# EAGLE design R302J (EAGLE 6.6.0)
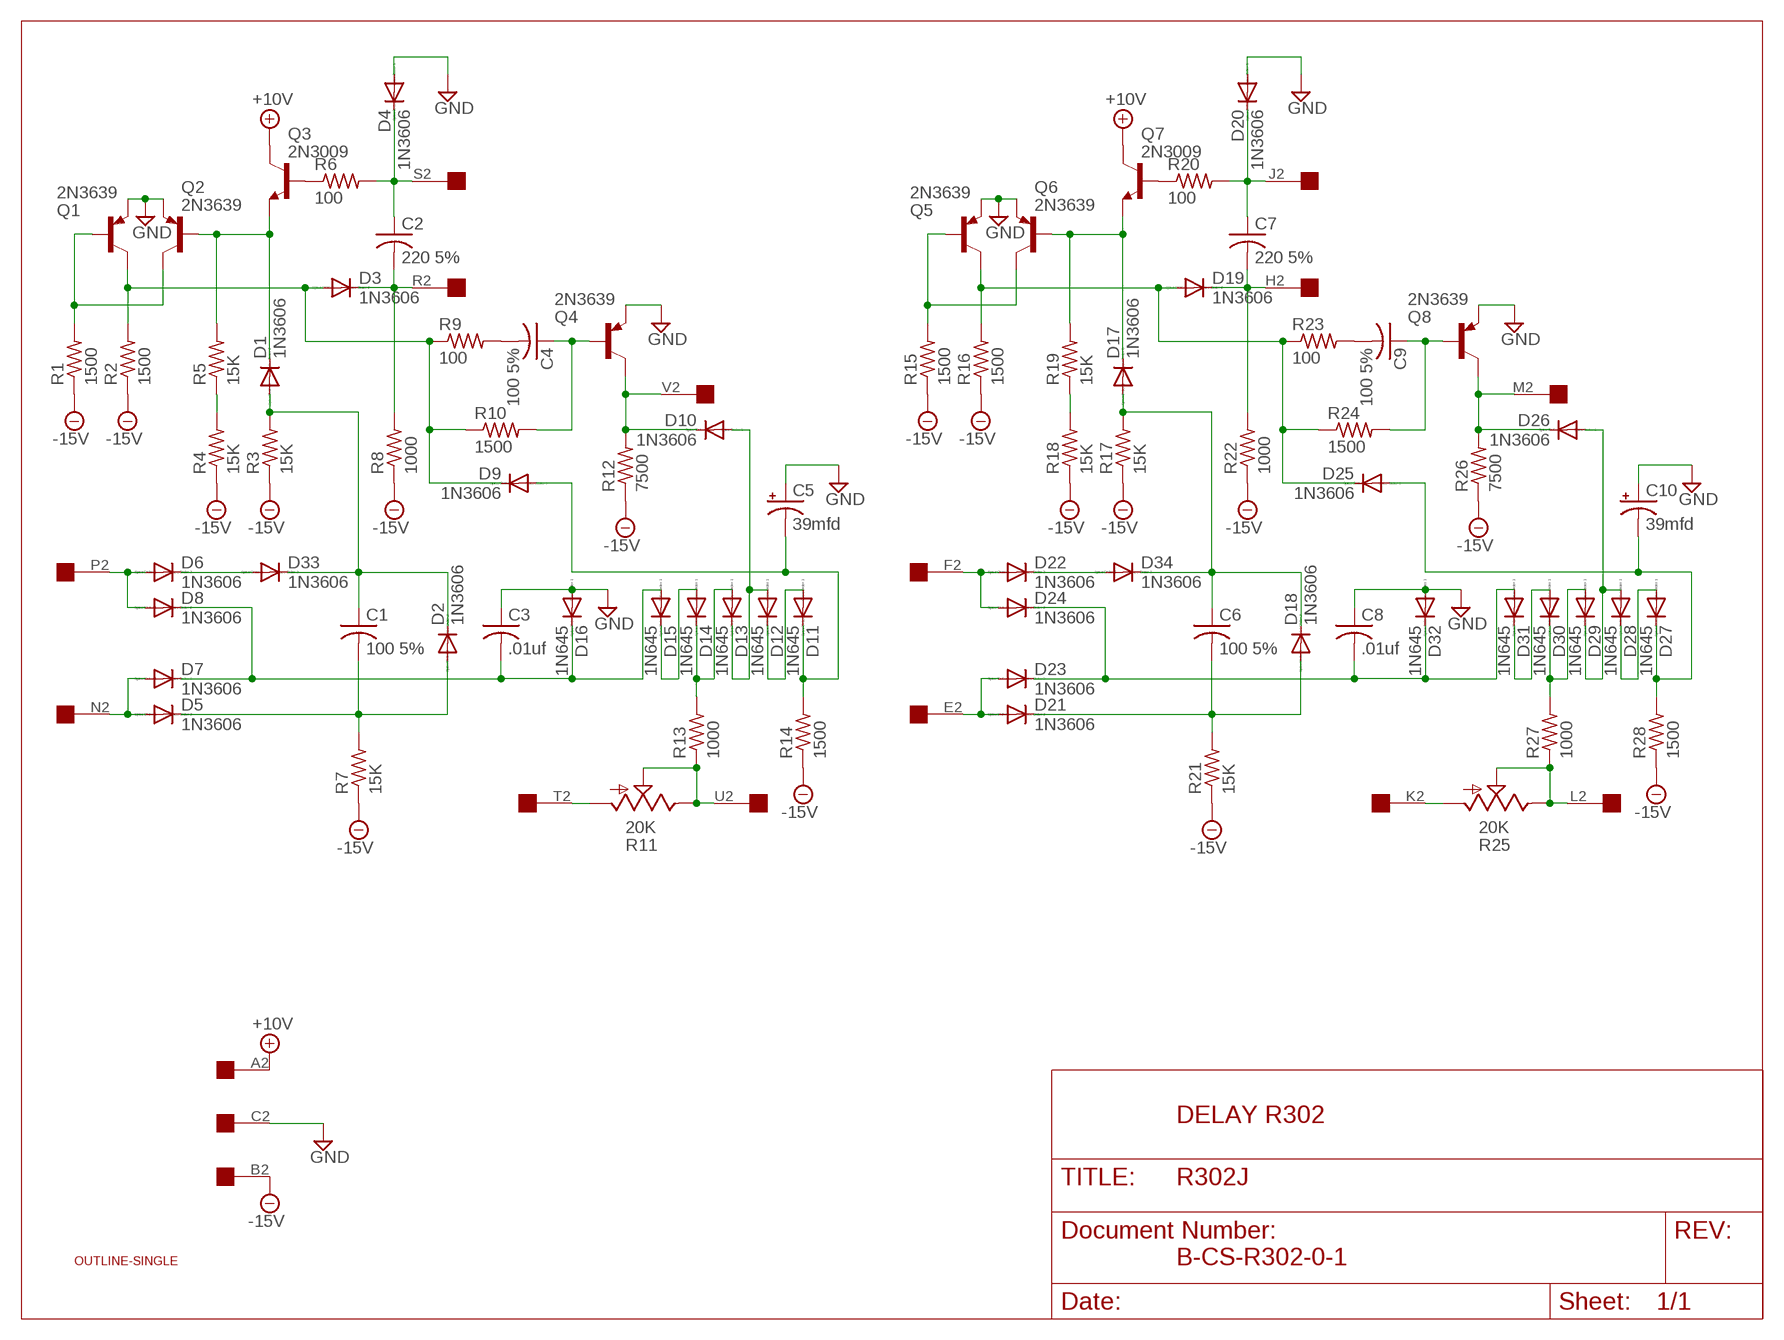
[diagram p0: schematic, sheet 1]

## Parts
C1  100 5%  C-US050-025X075  [C050-025X075]
C2  220 5%  C-US050-025X075  [C050-025X075]
C3  .01uf  C-US050-025X075  [C050-025X075]
C4  100 5%  C-US050-025X075  [C050-025X075]
C5  39mfd  CPOL-USE15-5AXIAL  [E15-5]
C6  100 5%  C-US050-025X075  [C050-025X075]
C7  220 5%  C-US050-025X075  [C050-025X075]
C8  .01uf  C-US050-025X075  [C050-025X075]
C9  100 5%  C-US050-025X075  [C050-025X075]
C10  39mfd  CPOL-USE15-5AXIAL  [E15-5]
D1  1N3606  1N4148DO35-10  [DO35-10]
D2  1N3606  1N4148DO35-10  [DO35-10]
D3  1N3606  1N4148DO35-10  [DO35-10]
D4  1N3606  1N4148DO35-10  [DO35-10]
D5  1N3606  1N4148DO35-10  [DO35-10]
D6  1N3606  1N4148DO35-10  [DO35-10]
D7  1N3606  1N4148DO35-10  [DO35-10]
D8  1N3606  1N4148DO35-10  [DO35-10]
D9  1N3606  1N4148DO35-10  [DO35-10]
D10  1N3606  1N4148DO35-10  [DO35-10]
D11  1N645  1N4148DO35-10  [DO35-10]
D12  1N645  1N4148DO35-10  [DO35-10]
D13  1N645  1N4148DO35-10  [DO35-10]
D14  1N645  1N4148DO35-10  [DO35-10]
D15  1N645  1N4148DO35-10  [DO35-10]
D16  1N645  1N4148DO35-10  [DO35-10]
D17  1N3606  1N4148DO35-10  [DO35-10]
D18  1N3606  1N4148DO35-10  [DO35-10]
D19  1N3606  1N4148DO35-10  [DO35-10]
D20  1N3606  1N4148DO35-10  [DO35-10]
D21  1N3606  1N4148DO35-10  [DO35-10]
D22  1N3606  1N4148DO35-10  [DO35-10]
D23  1N3606  1N4148DO35-10  [DO35-10]
D24  1N3606  1N4148DO35-10  [DO35-10]
D25  1N3606  1N4148DO35-10  [DO35-10]
D26  1N3606  1N4148DO35-10  [DO35-10]
D27  1N645  1N4148DO35-10  [DO35-10]
D28  1N645  1N4148DO35-10  [DO35-10]
D29  1N645  1N4148DO35-10  [DO35-10]
D30  1N645  1N4148DO35-10  [DO35-10]
D31  1N645  1N4148DO35-10  [DO35-10]
D32  1N645  1N4148DO35-10  [DO35-10]
D33  1N3606  1N4148DO35-10  [DO35-10]
D34  1N3606  1N4148DO35-10  [DO35-10]
Q1  2N3639  2N3637  [TO39]
Q2  2N3639  2N3637  [TO39]
Q3  2N3009  2N3019-NPN-TO39-EBC  [TO39]
Q4  2N3639  2N3637  [TO39]
Q5  2N3639  2N3637  [TO39]
Q6  2N3639  2N3637  [TO39]
Q7  2N3009  2N3019-NPN-TO39-EBC  [TO39]
Q8  2N3639  2N3637  [TO39]
R1  1500  R-US_0207/10  [0207/10]
R2  1500  R-US_0207/10  [0207/10]
R3  15K  R-US_0207/10  [0207/10]
R4  15K  R-US_0207/10  [0207/10]
R5  15K  R-US_0207/10  [0207/10]
R6  100  R-US_0207/10  [0207/10]
R7  15K  R-US_0207/10  [0207/10]
R8  1000  R-US_0207/10  [0207/10]
R9  100  R-US_0207/10  [0207/10]
R10  1500  R-US_0207/10  [0207/10]
R11  20K  TRIM_US-S43P  [SP19L]
R12  7500  R-US_0207/10  [0207/10]
R13  1000  R-US_0207/10  [0207/10]
R14  1500  R-US_0207/10  [0207/10]
R15  1500  R-US_0207/10  [0207/10]
R16  1500  R-US_0207/10  [0207/10]
R17  15K  R-US_0207/10  [0207/10]
R18  15K  R-US_0207/10  [0207/10]
R19  15K  R-US_0207/10  [0207/10]
R20  100  R-US_0207/10  [0207/10]
R21  15K  R-US_0207/10  [0207/10]
R22  1000  R-US_0207/10  [0207/10]
R23  100  R-US_0207/10  [0207/10]
R24  1500  R-US_0207/10  [0207/10]
R25  20K  TRIM_US-S43P  [SP19L]
R26  7500  R-US_0207/10  [0207/10]
R27  1000  R-US_0207/10  [0207/10]
R28  1500  R-US_0207/10  [0207/10]
U$1  OUTLINE-SINGLE  [SINGLE]
U$2  EDGE-1  [EDGE-CON1]

## Nets
+10V [Power]: Q3.3(C) Q7.3(C) U$2.A2
-15V [Power]: R1.1 R2.1 R3.1 R4.1 R7.1 R8.1 R12.1 R14.1 R15.1 R16.1 R17.1 R18.1 R21.1 R22.1 R26.1 R28.1 U$2.B2
GND [Power]: C3.1 C5.+ C8.1 C10.+ D4.A D16.A D20.A D32.A Q1.1(E) Q2.1(E) Q4.1(E) Q5.1(E) Q6.1(E) Q8.1(E) U$2.C2
N$1: C2.1 D4.C R6.2 U$2.S2
N$2: C2.2 D3.C R8.2 U$2.R2
N$3: D1.C Q2.2(B) Q3.1(E) R5.2
N$4: R4.2 R5.1
N$5: D22.A D24.A U$2.F2
N$6: Q3.2(B) R6.1
N$7: R11.E R11.S R13.1 U$2.U2
N$8: C1.1 D1.A D2.C D33.C R3.2
N$9: D5.A D7.A U$2.N2
N$10: R11.A U$2.T2
N$11: D6.C D33.A
N$12: D6.A D8.A U$2.P2
N$13: C1.2 D2.A D5.C R7.2
N$14: C3.2 D7.C D8.C D15.A D16.C
N$15: C4.2 R9.2
N$16: Q1.2(B) Q2.3(C) R1.2
N$17: C4.1 Q4.2(B) R10.2
N$18: D3.A D9.C Q1.3(C) R2.2 R9.1 R10.1
N$19: D10.C Q4.3(C) R12.2 U$2.V2
N$20: Q5.2(B) Q6.3(C) R15.2
N$21: D13.A D14.C R13.2
N$22: D11.A D12.C
N$23: D19.A D25.C Q5.3(C) R16.2 R23.1 R24.1
N$24: C5.- D9.A D11.C R14.2
N$25: D17.C Q6.2(B) Q7.1(E) R19.2
N$26: Q7.2(B) R20.1
N$27: C7.1 D20.C R20.2 U$2.J2
N$28: C7.2 D19.C R22.2 U$2.H2
N$29: R18.2 R19.1
N$30: D22.C D34.A
N$31: C6.1 D17.A D18.C D34.C R17.2
N$32: C6.2 D18.A D21.C R21.2
N$33: D21.A D23.A U$2.E2
N$34: C8.2 D23.C D24.C D31.A D32.C
N$35: C9.2 R23.2
N$36: C9.1 Q8.2(B) R24.2
N$37: D26.C Q8.3(C) R26.2 U$2.M2
N$38: D29.A D30.C R27.2
N$39: D27.A D28.C
N$40: C10.- D25.A D27.C R28.2
N$41: R25.E R25.S R27.1 U$2.L2
N$42: R25.A U$2.K2
N$43: D10.A D12.A D13.C
N$44: D14.A D15.C
N$45: D30.A D31.C
N$46: D26.A D28.A D29.C
Unconnected: U$2.D2

## Notes on the sheet
- DELAY R302
- B-CS-R302-0-1

## Library data of the parts
C1-C4 C6-C9 = rcl:C-US: CAPACITOR, American symbol
C5 C10 = rcl:CPOL-US: POLARIZED CAPACITOR, American symbol
D1-D34 = diode:1N4148: DIODE high speed (Philips)
Q1 Q2 Q4-Q6 Q8 = transistor-pnp:2N3637*: PNP Transistror
Q3 Q7 = transistor:*-NPN-: NPN Transistror BF959 corrected 2008.03.06
R1-R10 R12-R24 R26-R28 = rcl:R-US_: RESISTOR, American symbol
R11 R25 = pot:TRIM_US-: POTENTIOMETER
U$1 = dec-con:OUTLINE-*: Board outlines for DEC boards.
U$2 = dec-con:EDGE-1: Single-Sided DEC Edge Connector -- (side 2)

## Net classes
1 Power: width 0.813 mm

## Board
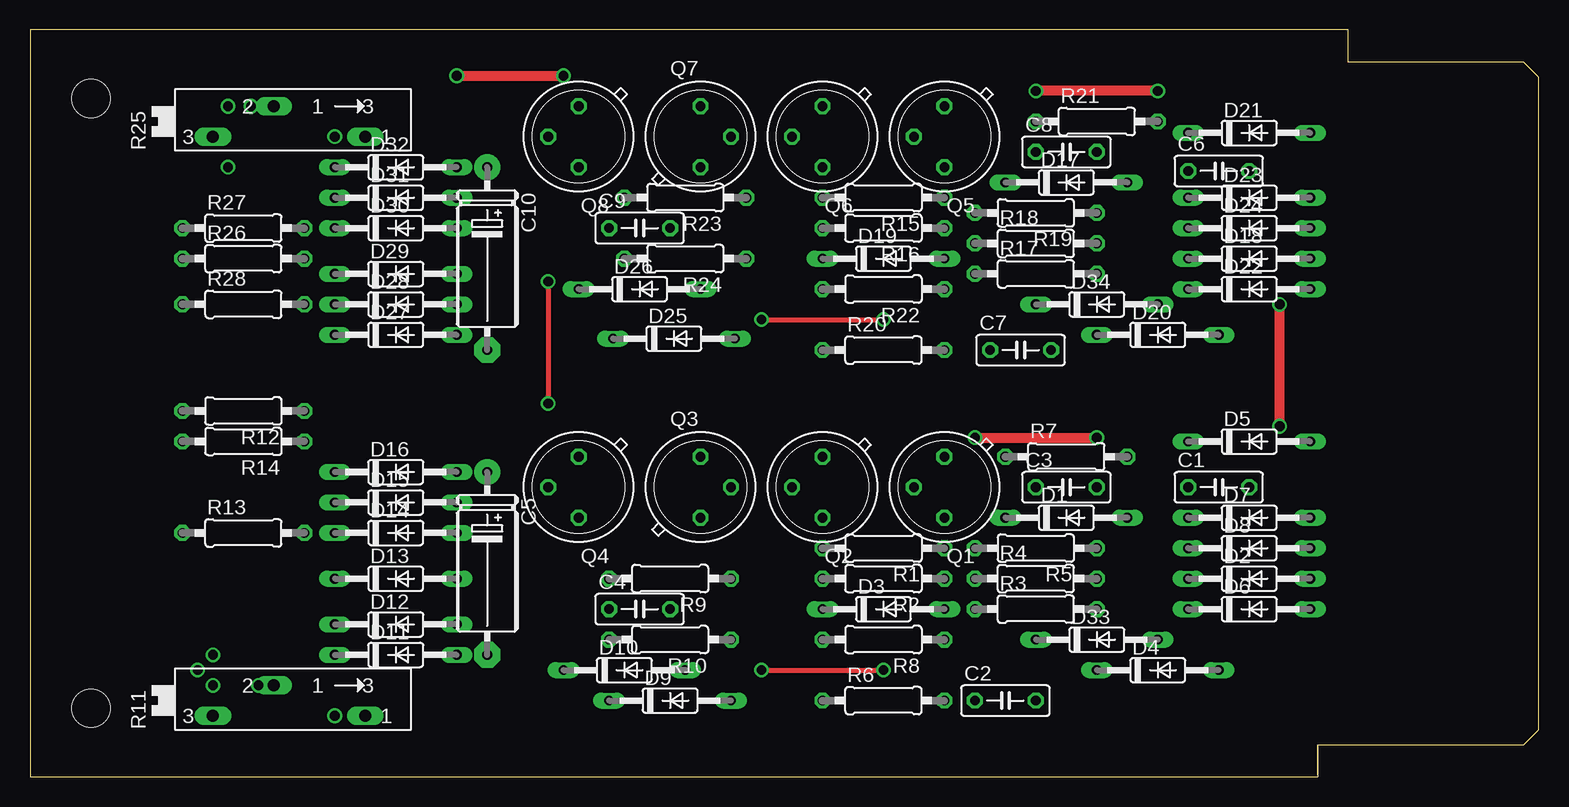
[diagram p1: board, top side]
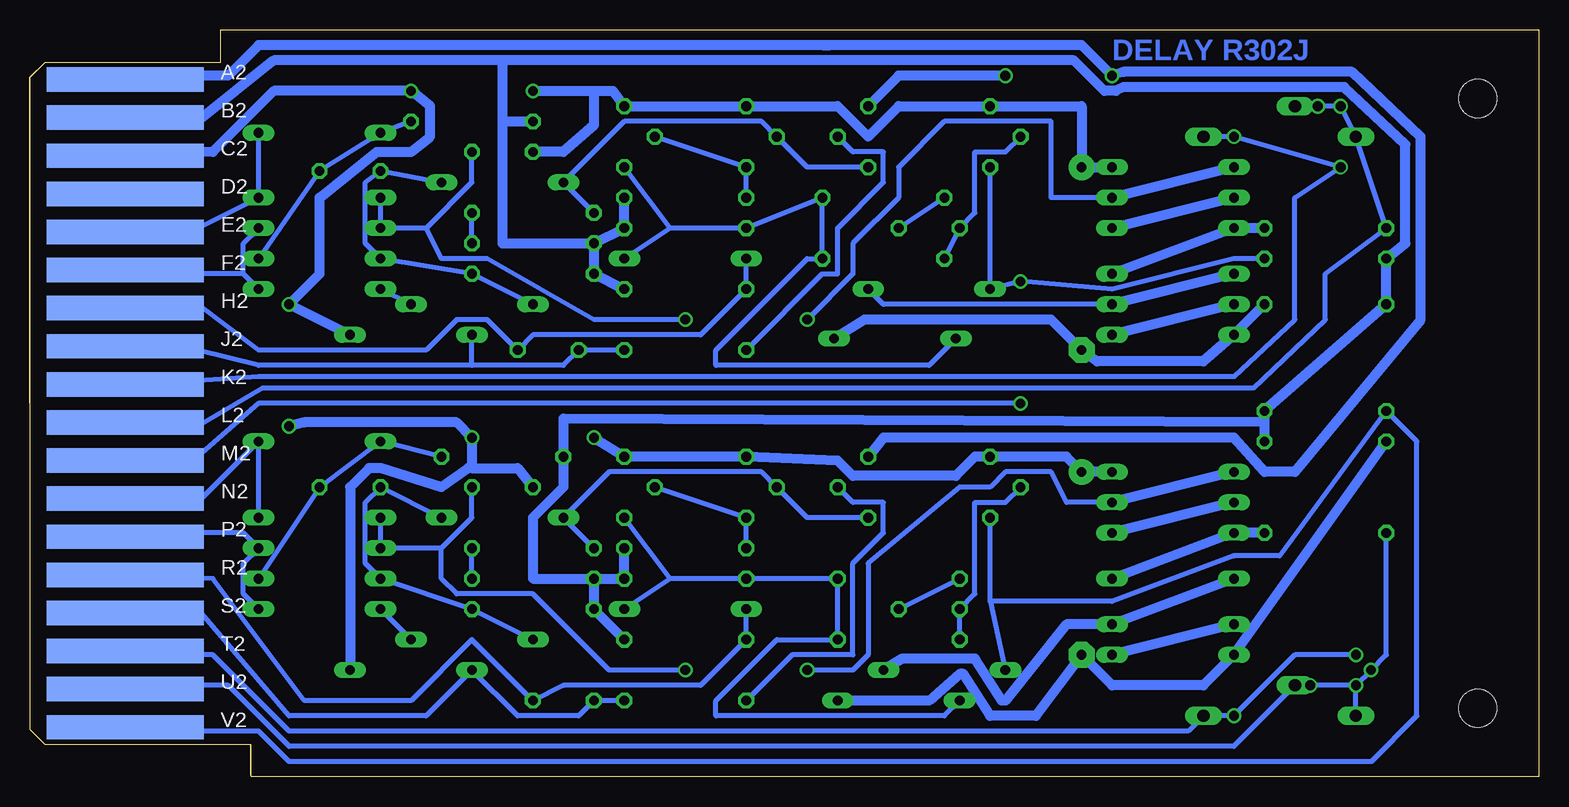
[diagram p2: board, bottom side, seen from below]

Size 125.73 x 62.23 mm. Coordinates in mm from the lower left corner, seen from the top.
Copper layers (1+16): Top 0.035mm / dielectric 1.5mm / Bottom 0.035mm
Design rules "16mils": minimum track width 16mil, minimum drill 32mil, track to track 15mil, track to pad 10mil, pad to pad 10mil, via to via 10mil, smd to smd 10mil, copper to edge 13mil, drill to drill 10mil, minimum pad ring 10mil, minimum via ring 8mil, stop-mask expansion 0mil, vias tented up to drill 0mil, thermal gap 10mil

### Footprints (pad centres in the part's own frame; a part is rotated, then mirrored left to right if it is on the bottom)
C050-025X075 = drill 0.813 octagon: 1 -2.54,0; 2 2.54,0
E15-5 = drill 0.813 pad 2.159: + -7.62,0 | drill 0.813 pad 2.159 octagon: - 7.62,0
DO35-10 = drill 0.813 long: A 5.08,0; C -5.08,0
TO39 = drill 0.813 octagon: 1 0,-2.54; 2 2.54,0; 3 0,2.54
0207/10 = drill 0.813 octagon: 1 -5.08,0; 2 5.08,0
SP19L = drill 1.016 long: A 5.715,-1.27; E -6.985,-1.27; S -1.905,1.27
SINGLE = hole 3.175: 120.65,56.515; 120.65,5.715
EDGE-CON1 = smd 13.106 x 2.032 bottom: A2 7.938,4.128; B2 7.938,7.303; C2 7.938,10.477; D2 7.938,13.652; E2 7.938,16.828; F2 7.938,20.003; H2 7.938,23.177; J2 7.938,26.352; K2 7.938,29.527; L2 7.938,32.703; M2 7.938,35.877; N2 7.938,39.053; P2 7.938,42.227; R2 7.938,45.403; S2 7.938,48.578; T2 7.938,51.752; U2 7.938,54.928; V2 7.938,58.102

### Placement (x,y rotation side)
C1  99.06,24.13 0 top
C2  81.28,6.35 0 top
C3  86.36,24.13 0 top
C4  50.8,13.97 0 top
C5  38.1,17.78 270 top
C6  99.06,50.48 0 top
C7  82.55,35.56 0 top
C8  86.36,52.07 0 top
C9  50.8,45.72 0 top
C10  38.1,43.18 270 top
D1  86.36,21.59 0 top
D2  101.6,16.51 0 top
D3  71.12,13.97 0 top
D4  93.98,8.89 0 top
D5  101.6,27.94 0 top
D6  101.6,13.97 0 top
D7  101.6,21.59 0 top
D8  101.6,19.05 0 top
D9  53.34,6.35 0 top
D10  49.53,8.89 0 top
D11  30.48,10.16 0 top
D12  30.48,12.7 0 top
D13  30.48,16.51 0 top
D14  30.48,20.32 0 top
D15  30.48,22.86 0 top
D16  30.48,25.4 0 top
D17  86.36,49.53 0 top
D18  101.6,43.18 0 top
D19  71.12,43.18 0 top
D20  93.98,36.83 0 top
D21  101.6,53.66 0 top
D22  101.6,40.64 0 top
D23  101.6,48.26 0 top
D24  101.6,45.72 0 top
D25  53.66,36.51 0 top
D26  50.8,40.64 0 top
D27  30.48,36.83 0 top
D28  30.48,39.37 0 top
D29  30.48,41.91 0 top
D30  30.48,45.72 0 top
D31  30.48,48.26 0 top
D32  30.48,50.8 0 top
D33  88.9,11.43 0 top
D34  88.9,39.37 0 top
Q1  76.2,24.13 180 top
Q2  66.04,24.13 180 top
Q3  55.88,24.13 0 top
Q4  45.72,24.13 180 top
Q5  76.2,53.34 180 top
Q6  66.04,53.34 180 top
Q7  55.88,53.34 0 top
Q8  45.72,53.34 180 top
R1  71.12,19.05 180 top
R2  71.12,16.51 180 top
R3  83.82,13.97 0 top
R4  83.82,16.51 0 top
R5  83.82,19.05 180 top
R6  71.12,6.35 0 top
R7  86.36,26.67 0 top
R8  71.12,11.43 180 top
R9  53.34,16.51 180 top
R10  53.34,11.43 180 top
R11  22.23,6.35 0 top
R12  17.78,30.48 180 top
R13  17.78,20.32 0 top
R14  17.78,27.94 180 top
R15  71.12,48.26 180 top
R16  71.12,45.72 180 top
R17  83.82,41.91 0 top
R18  83.82,44.45 0 top
R19  83.82,46.99 180 top
R20  71.12,35.56 0 top
R21  88.9,54.61 0 top
R22  71.12,40.64 180 top
R23  54.61,48.26 180 top
R24  54.61,43.18 180 top
R25  22.23,54.61 0 top
R26  17.78,43.18 0 top
R27  17.78,45.72 0 top
R28  17.78,39.37 0 top
U$1  125.73,62.23 180 top
U$2  125.73,62.23 180 top

### Tracks (layer width: path | path; a pad name or v marks a point on that pad's centre or on a via)
+10V  (via drill 0.81)
  Top 0.813: v35.56,58.42 v44.45,58.42
  Bottom 0.813: Q3.3 54.61,28.26 25.4,28.26 22.86,25.4 20.32,25.4 9.84,38.1 9.84,53.34 15.56,58.74 34.61,58.74 v35.56,58.42 38.1,60.96 59.69,60.96 | U$2.A2 111.76,58.42 109.22,58.42 106.68,60.96 101.6,60.96 59.69,60.96 | 59.69,60.96 59.05,60.96 | Q7.3 53.34,58.42 v44.45,58.42
-15V
  Bottom 0.813: R8.1 R3.1 R4.1 | R4.1 R2.1 R1.1 | 22.86,29.53 R14.1 | R4.1 83.82,16.51 83.82,21.59 81.28,24.13 R7.1 81.28,29.84 22.86,29.53 | 22.86,29.53 R12.1 R28.1 R26.1 11.11,44.45 11.11,52.7 16.19,57.47 34.61,57.47 35.24,57.15 36.2,57.15 38.73,59.69 86.36,59.69 | U$2.B2 111.76,54.61 105.41,59.69 86.36,59.69 | R22.1 R17.1 R18.1 | R18.1 R16.1 R15.1 | 86.36,54.61 86.36,44.45 R18.1 | 86.36,54.61 R21.1 | 86.36,59.69 86.36,54.61
GND  (via drill 0.81)
  Top 0.813: v78.74,28.26 v88.9,28.26 | v104.14,29.21 v104.14,39.37 | v93.98,57.15 v83.82,57.15
  Bottom 0.813: D4.A 99.06,24.13 97.47,25.72 96.52,25.72 91.44,24.13 89.22,25.72 88.9,25.72 | v78.74,28.26 Q1.1 Q2.1 58.42,26.35 57.15,25.08 48.58,25.08 46.99,26.67 Q4.1 39.37,26.67 C5.+ D16.A | 88.9,25.72 v88.9,28.26 90.17,29.53 102.87,29.53 v104.14,29.21 | 88.9,25.72 85.09,25.72 C3.1 | D32.A C10.+ 38.1,55.88 Q8.1 53.34,55.88 55.88,53.34 58.42,55.88 Q6.1 Q5.1 77.15,57.15 78.74,57.15 | D20.A v104.14,39.37 101.6,41.91 101.6,48.26 96.84,52.07 93.98,52.07 92.39,53.34 92.39,55.88 v93.98,57.15 105.41,57.15 110.49,52.07 U$2.C2 | v83.82,57.15 78.74,57.15 | C8.1 81.28,52.07 78.74,54.29 78.74,57.15
N$1
  Bottom 0.406: U$2.S2 111.45,13.66 104.14,5.08 92.71,5.08 D4.C 85.09,5.08 80.01,5.08 C2.1 R6.2
N$2
  Bottom 0.406: U$2.R2 110.49,16.51 102.87,6.35 93.98,6.35 88.9,11.43 C2.2 81.28,7.62 69.85,7.62 R8.2 D3.C
N$3
  Bottom 0.406: R5.2 D1.C 77.47,25.4 64.77,25.4 Q2.2 60.96,21.59 Q3.1
N$4
  Bottom 0.406: R4.2 R5.1
N$5
  Bottom 0.406: U$2.F2 111.76,41.91 107.95,41.91 | D22.A 107.95,41.91 | 107.95,41.91 107.95,44.45 D24.A
N$6
  Bottom 0.406: Q3.2 57.15,22.86 54.61,22.86 54.61,20.32 57.15,17.78 57.15,10.16 62.23,10.16 R6.1
N$7  (via drill 0.81)
  Bottom 0.406: U$2.U2 112.12,7.26 111.76,7.62 109.22,7.62 104.14,2.54 25.4,2.54 R11.S v19.05,7.62 v15.24,7.62 | R11.E v15.24,7.62 | R13.1 12.7,10.16 v13.97,8.89 v15.24,7.62
N$8
  Bottom 0.406: D33.C R3.2 D2.C 97.79,17.78 97.79,22.86 C1.1 D1.A
N$9
  Bottom 0.406: U$2.N2 112.7,23.19 111.76,22.86 D5.A D7.A
N$10  (via drill 0.81)
  Bottom 0.406: U$2.T2 112.09,10.49 111.76,10.16 110.49,10.16 104.14,3.81 29.21,3.81 R11.A v25.4,5.08 20.32,10.16 v15.24,10.16
N$11
  Bottom 0.406: D33.A D6.C
N$12
  Bottom 0.406: U$2.P2 112.7,19.99 111.76,20.32 107.95,20.32 D8.A 107.95,17.78 107.95,15.24 D6.A
N$13
  Bottom 0.406: D2.A C1.2 D5.C R7.2
N$14  (via drill 0.81)
  Top 0.406: v60.96,8.89 v71.12,8.89
  Bottom 0.406: D7.C D8.C 91.44,19.05 | C3.2 88.9,21.59 91.44,19.05 | D15.A 39.37,22.86 40.64,25.4 44.45,25.4 45.72,24.13 48.26,24.13 55.88,17.78 55.88,10.16 57.15,8.89 v60.96,8.89 | v71.12,8.89 77.47,8.89 83.82,15.24 90.17,15.24 91.44,16.51 91.44,19.05
  Bottom 0.813: D16.C D15.A
N$15
  Bottom 0.406: R9.2 C4.2
N$16
  Bottom 0.406: Q1.2 Q2.3 R1.2
N$17
  Bottom 0.406: R10.2 C4.1 46.99,15.24 46.99,22.86 44.45,22.86 Q4.2
N$18
  Bottom 0.406: 72.39,16.51 D3.A | 72.39,16.51 Q1.3 | 72.39,16.51 R2.2 R9.1 R10.1 63.5,11.43 68.58,6.35 68.58,5.08 49.53,5.08 D9.C
N$19
  Bottom 0.406: U$2.V2 111.76,4.13 111.76,3.81 106.68,3.81 104.14,1.27 13.97,1.27 10.16,5.08 10.16,27.94 R12.2 21.59,18.41 25.4,18.41 35.56,14.61 45.72,14.61 | 45.72,14.61 Q4.3 | 45.72,14.61 D10.C
N$20
  Bottom 0.406: R15.2 Q6.3 Q5.2
N$21
  Bottom 0.813: D13.A D14.C R13.2
N$22
  Bottom 0.813: D12.C D11.A
N$23
  Bottom 0.406: D25.C 50.8,34.29 68.58,34.29 68.58,35.56 60.96,43.18 R24.1 R23.1 R16.2 72.39,45.72 | 72.39,45.72 D19.A | 72.39,45.72 Q5.3
N$24
  Bottom 0.813: R14.2 D11.C 27.94,7.62 35.56,7.62 C5.- 41.91,5.08 45.72,5.08 47.94,8.57 48.26,8.57 50.8,6.35 D9.A
N$25
  Bottom 0.406: Q7.1 60.96,50.8 Q6.2 64.77,54.61 76.2,54.61 D17.C R19.2
N$26
  Bottom 0.406: Q7.2 57.15,52.07 54.61,52.07 54.61,49.53 58.42,45.72 58.42,41.91 59.69,41.91 R20.1
N$27
  Bottom 0.406: R20.2 C7.1 81.28,34.29 88.9,34.29 | U$2.J2 111.76,35.56 106.68,34.29 88.9,34.29 | 88.9,34.29 D20.C
N$28
  Bottom 0.406: D19.C R22.2 69.85,36.83 83.82,36.83 C7.2 87.63,38.1 90.17,38.1 92.71,35.56 106.68,35.56 111.76,39.37 U$2.H2
N$29
  Bottom 0.406: R18.2 R19.1
N$30
  Bottom 0.406: D34.A D22.C
N$31
  Bottom 0.406: D34.C R17.2 D18.C 97.79,44.45 97.79,49.53 C6.1 D17.A
N$32
  Bottom 0.406: D18.A C6.2 D21.C R21.2
N$33
  Bottom 0.406: U$2.E2 111.76,45.72 D23.A D21.A
N$34  (via drill 0.81)
  Top 0.406: v60.96,38.1 v71.12,38.1
  Bottom 0.406: D23.C D24.C 92.71,45.72 | C8.2 88.9,49.53 92.71,45.72 | D31.A 40.64,48.26 40.64,54.61 49.53,54.61 53.34,50.8 53.34,48.26 57.15,44.45 57.15,41.91 v60.96,38.1 | v71.12,38.1 78.74,38.1 87.63,43.18 91.44,43.18 92.71,45.72
  Bottom 0.813: D32.C D31.A
N$35
  Bottom 0.406: R23.2 C9.2
N$36
  Bottom 0.406: Q8.2 44.45,52.07 46.99,52.07 46.99,46.99 C9.1 R24.2
N$37  (via drill 0.81)
  Top 0.406: v43.18,41.27 v43.18,31.11
  Bottom 0.406: R26.2 25.4,43.18 35.56,40.64 v43.18,41.27 | v43.18,41.27 D26.C | D26.C Q8.3 | U$2.M2 111.76,26.67 106.68,31.11 v43.18,31.11 | v43.18,41.27 D26.C
N$38
  Bottom 0.813: R27.2 D30.C D29.A
N$39
  Bottom 0.813: D28.C D27.A
N$40
  Bottom 0.813: R28.2 D27.C 27.94,34.61 36.83,34.61 C10.- 40.64,38.1 56.2,38.1 D25.A
N$41  (via drill 0.81)
  Bottom 0.406: R25.S v18.41,55.88 v16.51,55.88 R25.E R27.1 17.78,41.91 17.78,38.1 23.81,32.38 106.36,32.38 111.76,29.21 U$2.L2
N$42  (via drill 0.81)
  Bottom 0.406: R25.A v25.4,53.34 v16.51,50.8 20.32,48.26 20.32,38.1 25.4,33.34 106.68,33.34 111.76,33.02 U$2.K2
N$43
  Bottom 0.813: D13.C D12.A 39.37,12.7 44.45,6.35 44.77,6.35 46.99,9.84 53.02,9.84 D10.A
N$44
  Bottom 0.813: D15.C D14.A
N$45
  Bottom 0.813: D31.C D30.A
N$46
  Bottom 0.406: D28.A 54.61,39.37 D26.A
  Bottom 0.813: D29.C D28.A

### Text on the board
Bottom: DELAY R302J